# EAGLE schematic 555_project_analog_swu_board_revA (EAGLE 7.6.0)
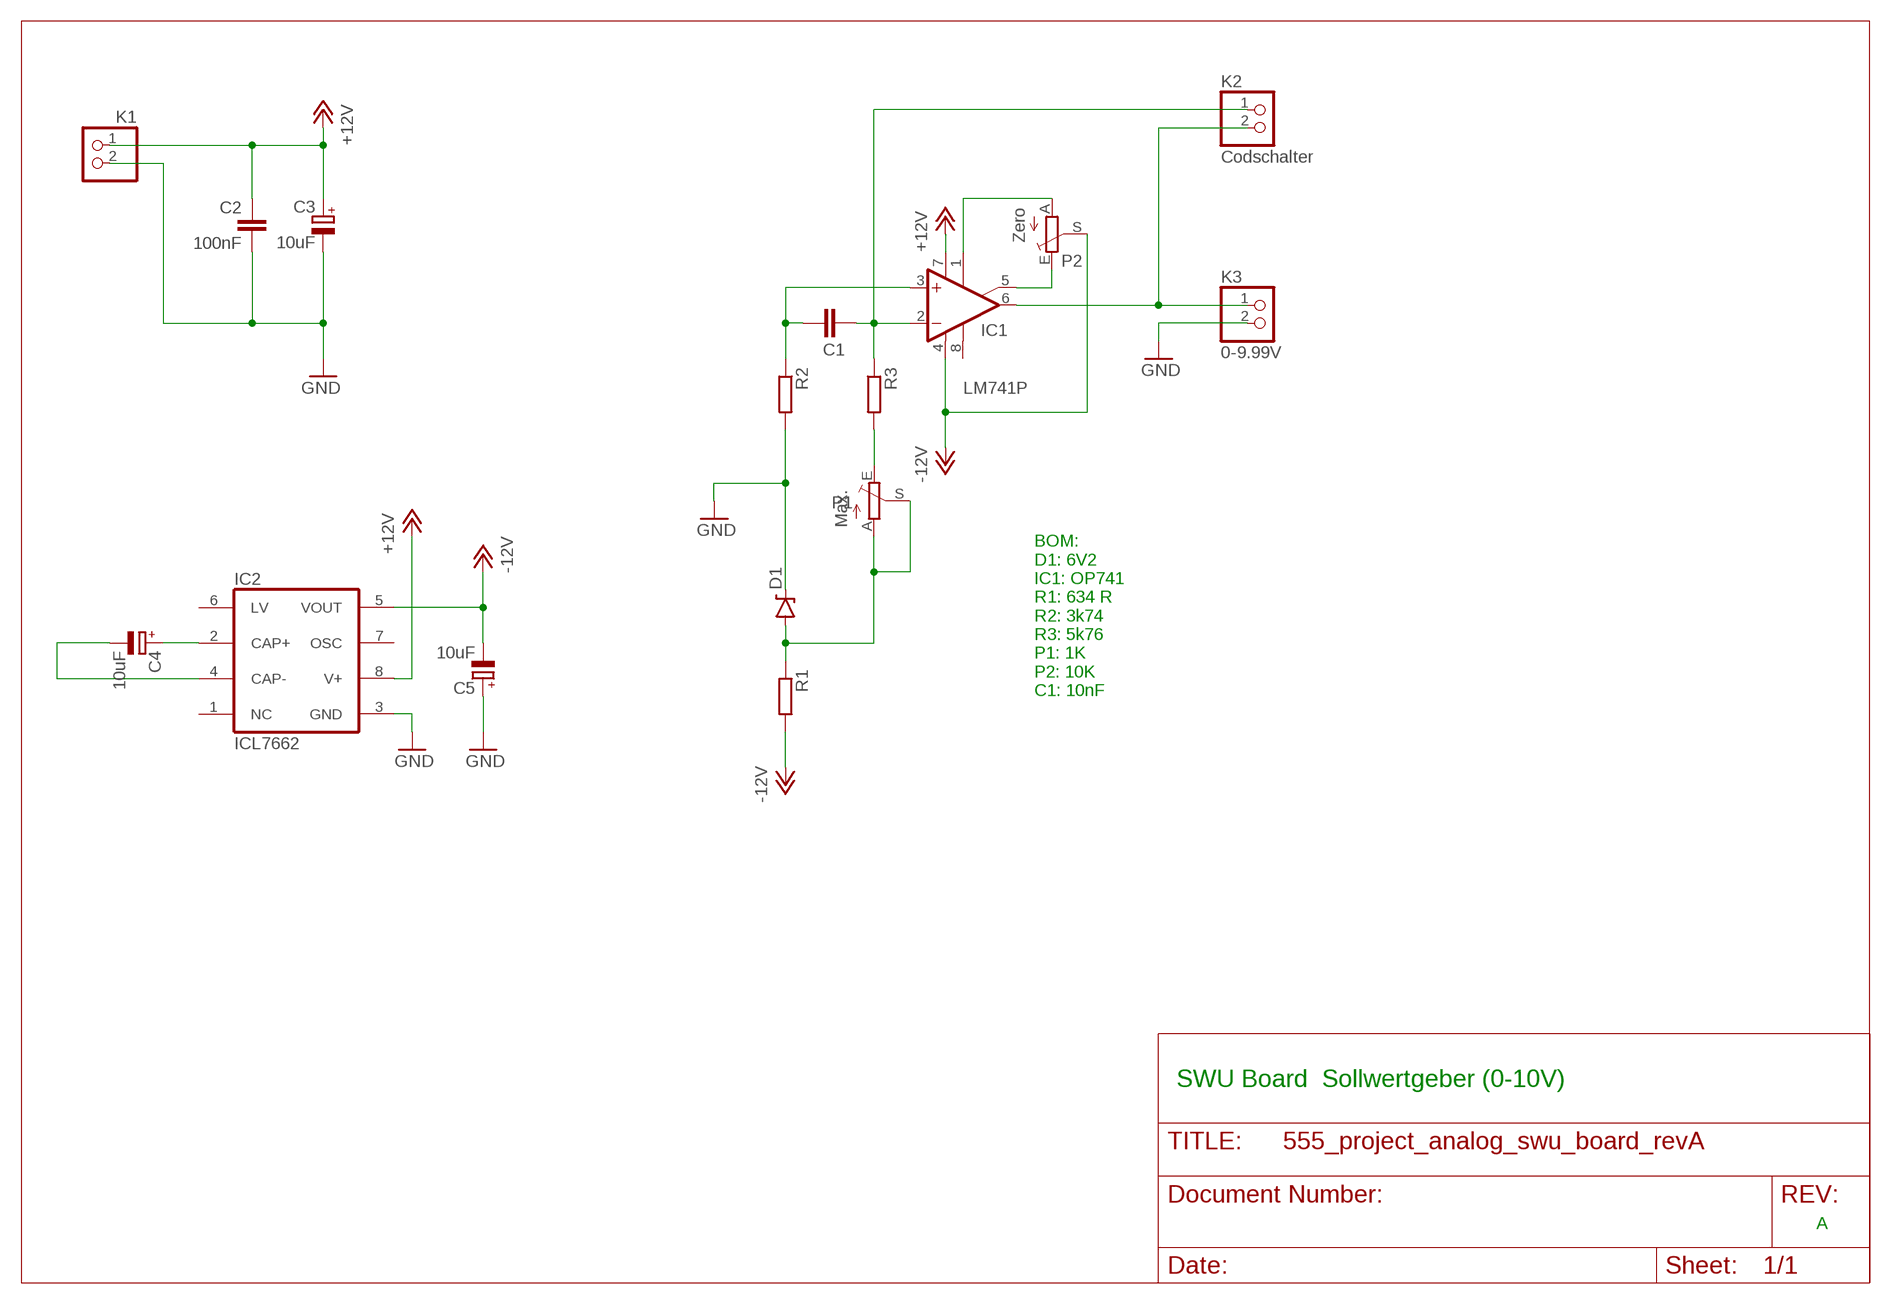
[diagram p0: schematic, sheet 1]

## Parts
C1  C-EU025-024X044  [C025-024X044]
C2  100nF  C-EU025-024X044  [C025-024X044]
C3  10uF  CPOL-EUE2.5-5  [E2,5-5]
C4  10uF  CPOL-EUE2.5-5  [E2,5-5]
C5  10uF  CPOL-EUE2.5-5  [E2,5-5]
D1  DIODE-ZENERPTH  [DIODE-ZENER]
IC1  LM741P  [DIL08]
IC2  ICL7662  ICL7660CPA  [DIL08]
K1  PINHD-1X2  [1X02]
K2  Codschalter  PINHD-1X2  [1X02]
K3  0-9.99V  PINHD-1X2  [1X02]
P1  Max.  TRIM_EU-LI10  [LI10]
P2  Zero  TRIM_EU-LI10  [LI10]
R1  R-EU_0207/10  [0207/10]
R2  R-EU_0207/10  [0207/10]
R3  R-EU_0207/10  [0207/10]

## Nets
0: IC1.6(OUT) K2.2 K3.1
+12V: C2.1 C3.+ IC1.7(V+) IC2.8(V+) K1.1
-12V: C5.- IC1.4(V-) IC2.5(VOUT) P2.S R1.2
C: C1.2 IC1.2(-IN) K2.1 R3.1
GND: C2.2 C3.- C5.+ D1.P$1(C) IC2.3(GND) K1.2 K3.2 R2.2
N$4: IC1.1(ON1) P2.A
N$5: IC1.5(ON2) P2.E
N$6: C1.1 IC1.3(+IN) R2.1
N$7: P1.E R3.2
N$8: D1.P$2(A) P1.A P1.S R1.1
N$9: C4.+ IC2.2(CAP+)
N$10: C4.- IC2.4(CAP-)
Unconnected: IC1.8(OPT) IC2.1(NC) IC2.6(LV) IC2.7(OSC)

## Notes on the sheet
- BOM:
  D1: 6V2
  IC1: OP741
  R1: 634 R
  R2: 3k74
  R3: 5k76
  P1: 1K
  P2: 10K
  C1: 10nF
- SWU Board  Sollwertgeber (0-10V)
- A

## Library data of the parts
C1 C2 = resistor:C-EU: CAPACITOR, European symbol
C3-C5 = resistor:CPOL-EU: POLARIZED CAPACITOR, European symbol
D1 = SparkFun-DiscreteSemi:DIODE-ZENER: Zener Diode Production Part - 8199 3.4V Zener Voltage
IC1 = linear:*741: OP AMP
IC2 = maxim:ICL7660CPA: VOLTAGE CONVERTER; MF: INTERSIL; MPN: ICL7660CPA; OC_FARNELL: 1018170; OC_NEWARK: 06F7441
K1-K3 = pinhead:PINHD-1X2: PIN HEADER
P1 P2 = pot:TRIM_EU-: POTENTIOMETER
R1-R3 = resistor:R-EU_: RESISTOR, European symbol